# Altium schematic sheet frontpanel-hw.SchDoc
size A3; SheetNumber: 3; SheetTotal: 10
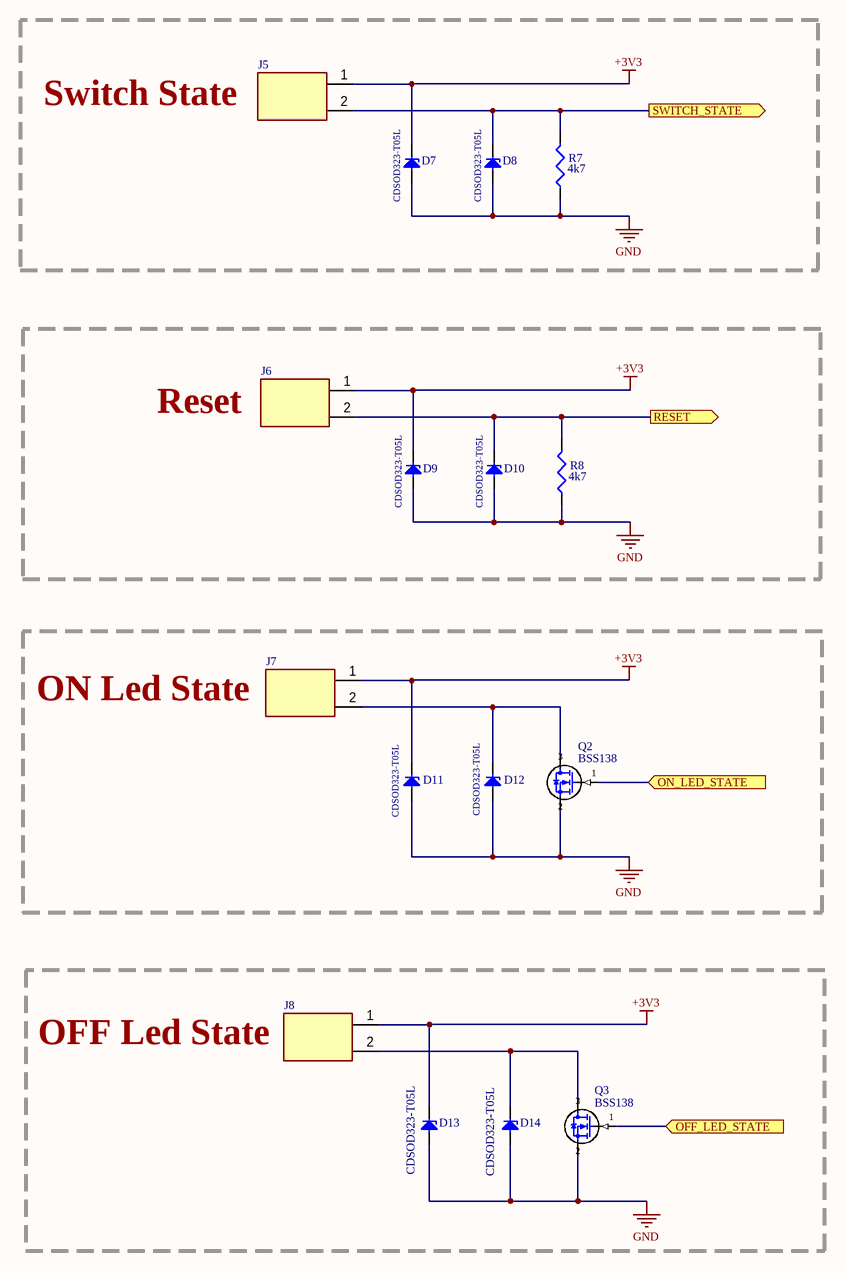
[diagram p0: frontpanel-hw.SchDoc]

## Parts
D7  CDSOD323-T05L  [SOD-323]
D8  CDSOD323-T05L  [SOD-323]
D9  CDSOD323-T05L  [SOD-323]
D10  CDSOD323-T05L  [SOD-323]
D11  CDSOD323-T05L  [SOD-323]
D12  CDSOD323-T05L  [SOD-323]
D13  CDSOD323-T05L  [SOD-323]
D14  CDSOD323-T05L  [SOD-323]
J5  +15VDC Connector  [+15VDC Connector]  (value not drawn)
J6  +15VDC Connector  [+15VDC Connector]  (value not drawn)
J7  +15VDC Connector  [+15VDC Connector]  (value not drawn)
J8  +15VDC Connector  [+15VDC Connector]  (value not drawn)
Q2  BSS138  [SOT_23_3]
Q3  BSS138  [SOT_23_3]
R7  4k7  [Resistor 0805]
R8  4k7  [Resistor 0805]

## Blocks framed on the sheet
Switch State: D7 D8 J5 R7
Reset: D9 D10 J6 R8
ON Led State: D11 D12 J7 Q2
OFF Led State: D13 D14 J8 Q3

## Ports
OFF_LED_STATE (in, see beaglebone-interface-hw[4A]), ON_LED_STATE (in, see beaglebone-interface-hw[3A]), RESET (out, see beaglebone-interface-hw[2C]), SWITCH_STATE (out, see beaglebone-interface-hw[2C])

## Nets
+3V3: D7.1 D9.1 D11.1 D13.1 J5.1 J6.1 J7.1 J8.1
GND: D7.2 D8.2 D9.2 D10.2 D11.2 D12.2 D13.2 D14.2 Q2.2(S) Q3.2(S) R7.1 R8.1
OFF_LED_STATE: Q3.1(G) ; port OFF_LED_STATE
ON_LED_STATE: Q2.1(G) ; port ON_LED_STATE
RESET: D10.1 J6.2 R8.2 ; port RESET
SWITCH_STATE: D8.1 J5.2 R7.2 ; port SWITCH_STATE
NetD12_1: D12.1 J7.2 Q2.3(D)
NetD14_1: D14.1 J8.2 Q3.3(D)

## Notes on the sheet
- Title:
- Date:
- Project:
- Drawn by:
- Time:
- Revision:
- Sheet
- of
- ENT - AIS - SEI
  Sistemas Eletrônicos e
  Instrumentação
- Copyright CNPEM 2023.
  This documentation describes Open Hardware and is licensed under the CERN OHL S v2. You may redistribute and modify this documentation under the terms of the CERN OHL S v2. (https://www.ohwr.org/cernohl). This documentation is distributed WITHOUT ANY EXPRESS OR IMPLIED WARRANTY, INCLUDING OF MERCHANTABILITY, SATISFACTORY QUALITY AND FITNESS FOR A PARTICULAR PURPOSE. Please see the CERN OHL S v2 for applicable conditions.
- File:

## Library data of the parts
D7-D14 = CDSOD323-T05L: Unidirectional TVS Diode; Supplier 1: Avnet; Supplier Part Number 1: CDSOD323-T05L
Q2 Q3 = BSS138: MOSFET N-Channel; Supplier 1: Digi-Key; Supplier Part Number 1: BSS138DKR-ND
R7 R8 = Resistor 4k7: Size 0805